# Altium schematic sheet LoRa_Test_Board_Sheet.SchDoc
size A4; SheetNumber: 1; SheetTotal: 1
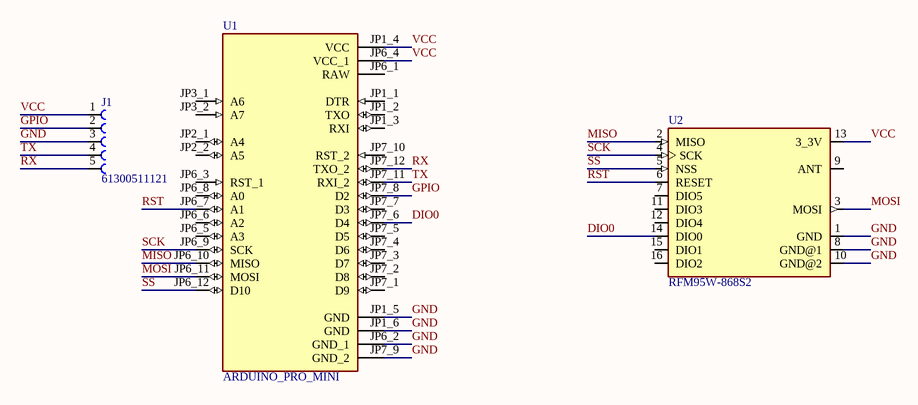
[diagram p0: LoRa_Test_Board_Sheet.SchDoc]

## Parts
J1  61300511121  [61300511121]
U1  ARDUINO_PRO_MINI  [MODULE_ARDUINO_PRO_MINI]
U2  RFM95W-868S2  [XCVR_RFM95W-868S2]

## Nets
DIO0: U1.JP7_6(D4) U2.14(DIO0)
GND: J1.3 U1.JP1_5(GND) U1.JP1_6(GND) U1.JP6_2(GND_1) U1.JP7_9(GND_2) U2.1(GND) U2.8(GND@1) U2.10(GND@2)
GPIO: J1.2 U1.JP7_8(D2)
MISO: U1.JP6_10(MISO) U2.2(MISO)
MOSI: U1.JP6_11(MOSI) U2.3(MOSI)
RST: U1.JP6_7(A1) U2.6(RESET)
RX: J1.5 U1.JP7_12(TXO_2)
SCK: U1.JP6_9(SCK) U2.4(SCK)
SS: U1.JP6_12(D10) U2.5(NSS)
TX: J1.4 U1.JP7_11(RXI_2)
VCC: J1.1 U1.JP1_4(VCC) U1.JP6_4(VCC_1) U2.13(3_3V)

Not connected (* = marked no-connect by the designer): U1 JP1_1(DTR) JP1_2(TXO) JP1_3(RXI) JP2_1(A4) JP2_2(A5) JP3_1(A6) JP3_2(A7) JP6_1(RAW) JP6_3(RST_1) JP6_5(A3) JP6_6(A2) JP6_8(A0) JP7_1(D9) JP7_2(D8) JP7_3(D7) JP7_4(D6) JP7_5(D5) JP7_7(D3) JP7_10(RST_2); U2 7(DIO5) 9(ANT) 11(DIO3) 12(DIO4) 15(DIO1) 16(DIO2)

## Library data of the parts
J1 = 61300511121: Connector Header Through Hole 5 position 0.100 (2.54mm); MF: WÃ¼rth Elektronik; Check_prices: https://www.snapeda.com/parts/61300511121/Wurth+Elektronik/view-part/?ref=eda; Value: *; Purchase-URL: https://pricing.snapeda.com/search/part/61300511121/?ref=eda; Price: None; MP: 61300511121; SnapEDA_Link: https://www.snapeda.com/parts/61300511121/Wurth+Elektronik/view-part/?ref=snap; Availability: In Stock; Package: None
U1 = ARDUINO_PRO_MINI: This board was developed for applications and installations where space is premium and projects are made as permanent set ups. Small, available in 3.3 V and 5 V versions, powered by ATmega328P.; MP: Arduino Pro Mini; Price: None; Availability: Not in stock; Package: None; Value: *; SnapEDA_Link: https://www.snapeda.com/parts/Arduino%20Pro%20Mini/Arduino/view-part/?ref=snap; MF: Arduino; Check_prices: https://www.snapeda.com/parts/Arduino%20Pro%20Mini/Arduino/view-part/?ref=eda
U2 = RFM95W-868S2: General ISM < 1GHz LoRaâ„¢ Transceiver Module 868MHz Antenna Not Included Surface Mount; MF: RF; Purchase-URL: https://pricing.snapeda.com/search/part/RFM95W-868S2/?ref=eda; Package: Non Standard RF Solutions; Price: None; MP: RFM95W-868S2; Availability: In Stock; SnapEDA_Link: https://www.snapeda.com/parts/RFM95W-868S2/RF+Solutions/view-part/?ref=snap; Check_prices: https://www.snapeda.com/parts/RFM95W-868S2/RF+Solutions/view-part/?ref=eda; Value: *